# EAGLE schematic B00141111 (EAGLE 9.6.2)
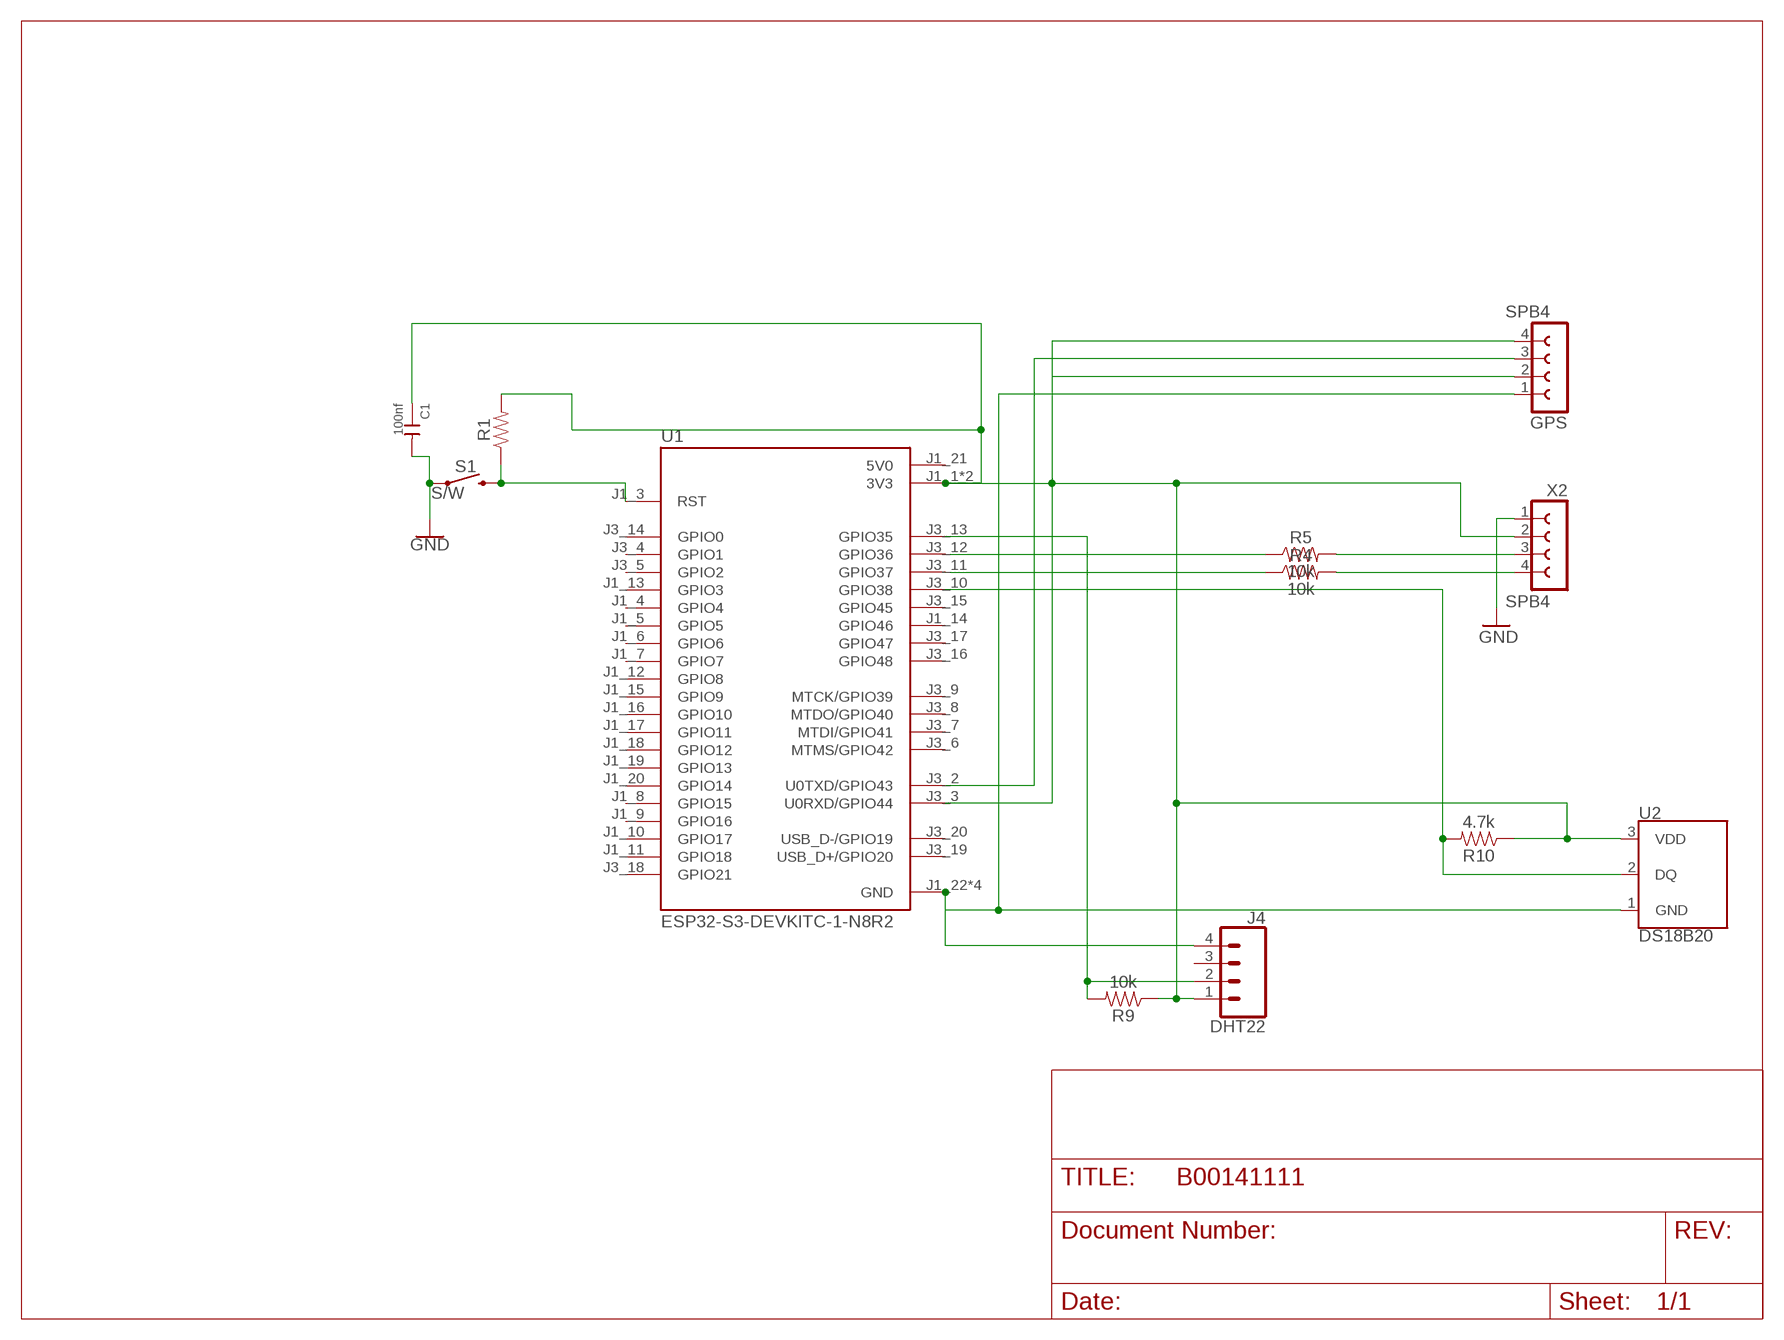
[diagram p0: schematic, sheet 1]

## Parts
C1  100nf  DIP-CERAMIC-DISC-100NF-50V-Y5V(D5.0MM)  [CERAMIC-2.54]
GPS  SPB4  [SPB4]
J4  DHT22  CONN_04POLAR  [MOLEX-1X4]
R1  RESISTORAXIAL-0.3  [AXIAL-0.3]
R4  10k  10KOHM-HORIZ-1/4W-1%  [AXIAL-0.3]
R5  10k  10KOHM-HORIZ-1/4W-1%  [AXIAL-0.3]
R9  10k  RESISTORAXIAL-0.3  [AXIAL-0.3]
R10  4.7k  RESISTORAXIAL-0.3  [AXIAL-0.3]
S1  S/W  MOMENTARY-SWITCH-SPST-PTH-6.0MM  [TACTILE_SWITCH_PTH_6.0MM]
U1  ESP32-S3-DEVKITC-1-N8R2  [XCVR_ESP32-S3-DEVKITC-1-N8R2]
U2  DS18B20  [TO-92-AMMO]
X2  SPB4  [SPB4]

## Nets
GND: C1.2 S1.1 X2.1
N$1: GPS.1 J4.4 U1.J1_22(GND) U1.J3_1(GND) U1.J3_21(GND) U1.J3_22(GND) U2.1(GND)
N$3: R1.P$1 S1.3 U1.J1_3(RST)
N$4: R5.P$1 U1.J3_12(GPIO36)
N$5: R5.P$2 X2.3
N$6: R10.P$2 U1.J3_10(GPIO38) U2.2(DQ)
N$7: R4.P$1 U1.J3_11(GPIO37)
N$8: R4.P$2 X2.4
N$9: C1.1 GPS.2 J4.1 R1.P$2 R9.P$1 R10.P$1 U1.J1_1(3V3) U1.J1_2(3V3) U2.3(VDD) X2.2
N$10: GPS.3 U1.J3_2(U0TXD/GPIO43)
N$11: GPS.4 U1.J3_3(U0RXD/GPIO44)
N$17: J4.2 R9.P$2 U1.J3_13(GPIO35)
Unconnected: J4.3 U1.J1_4(GPIO4) U1.J1_5(GPIO5) U1.J1_6(GPIO6) U1.J1_7(GPIO7) U1.J1_8(GPIO15) U1.J1_9(GPIO16) U1.J1_10(GPIO17) U1.J1_11(GPIO18) U1.J1_12(GPIO8) U1.J1_13(GPIO3) U1.J1_14(GPIO46) U1.J1_15(GPIO9) U1.J1_16(GPIO10) U1.J1_17(GPIO11) U1.J1_18(GPIO12) U1.J1_19(GPIO13) U1.J1_20(GPIO14) U1.J3_4(GPIO1) U1.J3_5(GPIO2) U1.J3_6(MTMS/GPIO42) U1.J3_7(MTDI/GPIO41) U1.J3_8(MTDO/GPIO40) U1.J3_9(MTCK/GPIO39) U1.J3_14(GPIO0) U1.J3_15(GPIO45) U1.J3_16(GPIO48) U1.J3_17(GPIO47) U1.J3_18(GPIO21) U1.J3_19(USB_D+/GPIO20) U1.J3_20(USB_D-/GPIO19)

## Power pins joined to a net without a drawn wire
5V0: U1.J1_21(5V0)

## Library data of the parts
C1 = OPL_Capacitor:DIP-CERAMIC-DISC-100NF-50V-Y5V(D5.0MM): 302010208; MPN: CC1-F5SL2A101KSPW
GPS X2 = con-hirschmann:SPB4: CONNECTOR 4 pins; OC_FARNELL: unknown; OC_NEWARK: unknown
J4 = Test 1:CONN_04: Multi connection point. Often used as Generic Header-pin footprint for 0.1 inch spaced/style header connections On any of the 0.1 inch spaced packages, you can populate with these: Break Away Headers - Straight <https://www.sparkfun.com/products/116> (PRT-00116) Break Away Male Headers - Right Angle <https://www.sparkfun.com/products/553> (PRT-00553) Female Headers <https://www.sparkfun.com/products/115> (PRT-00115) Break Away Headers - Machine Pin <https://www.sparkfun.com/products/117> (PRT-00117) Break Away Female Headers - Swiss Machine Pin <https://www.sparkfun.com/products/743> (PRT-00743) For SCREWTERMINALS and SPRING TERMINALS visit here: Screw Terimnals on SparkFun.com <https://www.sparkfun.com/search/results?term=Screw+Terminals> (5mm/3.5mm/2.54mm spacing) This device is also useful as a general connection point to wire up your design to another part of your project. Our various solder wires solder well into these plated through hole pads. Hook-Up Wire - Assortment (Stranded, 22 AWG) <https://www.sparkfun.com/products/11375> (PRT-11375) Hook-Up Wire - Assortment (Solid Core, 22 AWG) <https://www.sparkfun.com/products/11367> (PRT-11367) View the entire wire category on our website here <https://www.sparkfun.com/categories/141> Special notes: Molex polarized connector foot print use with SKU : PRT-08231 with associated crimp pins and housings. 1MM SMD Version SKU: PRT-10208; PROD_ID: CONN-14363; SF_ID: PRT-08075; STOREFRONT_SKU: PRT-15900; VALUE: 1X04_SMD_STRAIGHT_COMBO
R1 = SparkFun-Resistors:RESISTOR: Generic Resistor Package
R4 R5 = SparkFun-Resistors:10KOHM: 10kΩ resistor A resistor is a passive two-terminal electrical component that implements electrical resistance as a circuit element. Resistors act to reduce current flow, and, at the same time, act to lower voltage levels within circuits. - Wikipedia; PROD_ID: RES-12183
R9 R10 = Test 1:RESISTOR: Generic Resistor Package
S1 = SparkFun-Switches:MOMENTARY-SWITCH-SPST: Momentary Switch (Pushbutton) - SPST Normally-open (NO) SPST momentary switches (buttons, pushbuttons). Variants PTH-12MM - 12mm square, through-hole Momentary Pushbutton Switch - 12mm Square <https://www.sparkfun.com/products/9190> (COM-09190) PTH-6.0MM, PTH-6.0MM-KIT - 6.0mm square, through-hole Mini Pushbutton Switch <https://www.sparkfun.com/products/97> (COM-00097) KIT package intended for soldering kit's - only one side of pads' copper is exposed. PTH-RIGHT-ANGLE-KIT - Right-angle, through-hole Right Angle Tactile Button <https://www.sparkfun.com/products/10791> - Used on SparkFun BigTime Watch Kit <https://www.sparkfun.com/products/11734> SMD-12MM - 12mm square, surface-mount Tactile Button - SMD (12mm) <https://www.sparkfun.com/products/12993> (COM-12993) Used on SparkFun PicoBoard <https://www.sparkfun.com/products/11888> SMD-4.5MM - 4.5mm Square Trackball Switch Used on SparkFun Blackberry Trackballer Breakout <https://www.sparkfun.com/products/13169> SMD-4.6MMX2.8MM - 4.60mm x 2.80mm, surface mount Used on SparkFun SAMD21 Mini Breakout <https://www.sparkfun.com/products/13664> SMD-5.2MM, SMD-5.2-REDUNDANT - 5.2mm square, surface-mount Mini Pushbutton Switch - SMD <https://www.sparkfun.com/products/8720> (COM-08720) Used on Arduino Pro Mini <https://www.sparkfun.com/products/11114> REDUNDANT package connects both switch circuits together SMD-6.0X3.5MM - 6.0 x 3.5mm, surface mount Momentary Reset Switch SMD <https://www.sparkfun.com/products/8229> (COM-08229) SMD-6.2MM-TALL - 6.2mm square, surface mount Tactile Button - SMD (6mm) <https://www.sparkfun.com/products/12992> Used on SparkFun Digital Sandbox <https://www.sparkfun.com/products/12651> SMD-RIGHT-ANGLE - Right-angle, surface mount Used on SparkFun Block for Intel® Edison - Arduino <https://www.sparkfun.com/products/13036>; PROD_ID: SWCH-08441; SF_SKU: COM-00097
U1 = ESP32-S3-DEVKITC-1-N8R2:ESP32-S3-DEVKITC-1-N8R2: Check availability <https://pricing.snapeda.com/parts/ESP32-S3-DEVKITC-1-N8R2/Espressif%20Systems/view-part?ref=eda>; AVAILABILITY: In Stock; CHECK_PRICES: https://www.snapeda.com/parts/ESP32-S3-DEVKITC-1-N8R2/Espressif+Systems/view-part/?ref=eda; DESCRIPTION: WiFi Development Tools - 802.11 (Engineering Samples Only) ESP32-S3 General-Purpose Development Board, ESP32-S3-WROOM-1-N8R2, with Pin Header; MF: Espressif Systems; MP: ESP32-S3-DEVKITC-1-N8R2; PACKAGE: None; PRICE: None; PURCHASE-URL: https://www.snapeda.com/api/url_track_click_mouser/?unipart_id=8918256&manufacturer=Espressif Systems&part_name=ESP32-S3-DEVKITC-1-N8R2&search_term=esp32-s3-devkitc-1-n8 r8; SNAPEDA_LINK: https://www.snapeda.com/parts/ESP32-S3-DEVKITC-1-N8R2/Espressif+Systems/view-part/?ref=snap
U2 = Test 1:DS18B20: Dallas/Maxim DS18B20 1-Wire Temperature Sensor The DS18B20 reports degrees C with 9 to 12-bit precision, -55C to 125C (+/-0.5C). Each sensor has a unique 64-Bit Serial number etched into it - allows for a huge number of sensors to be used on one data bus. Datasheet <http://datasheets.maximintegrated.com/en/ds/DS18B20.pdf> SparkFun Products One Wire Digital Temperature Sensor - DS18B20 <https://www.sparkfun.com/products/245> (SEN-00245); STORE_ID: SEN-00245